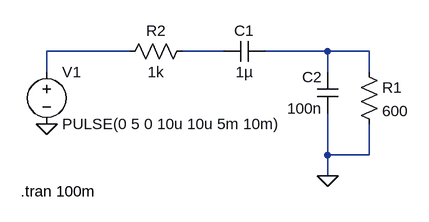
[diagram p0: schematic lab4_tob.asc]
lab4_tob.asc, the LTspice schematic file:
Version 4.1
SHEET 1 880 680
WIRE 256 128 128 128
WIRE 400 128 336 128
WIRE 560 128 464 128
WIRE 624 128 560 128
WIRE 128 160 128 128
WIRE 560 160 560 128
WIRE 624 160 624 128
WIRE 560 288 560 224
WIRE 624 288 624 240
WIRE 624 288 560 288
WIRE 560 320 560 288
FLAG 560 320 0
FLAG 128 240 0
SYMBOL res 352 112 R90
WINDOW 0 0 56 VBottom 2
WINDOW 3 32 56 VTop 2
SYMATTR InstName R2
SYMATTR Value 1k
SYMBOL cap 464 112 R90
WINDOW 0 0 32 VBottom 2
WINDOW 3 32 32 VTop 2
SYMATTR InstName C1
SYMATTR Value 1µ
SYMBOL cap 576 224 R180
WINDOW 0 24 56 Left 2
WINDOW 3 24 8 Left 2
SYMATTR InstName C2
SYMATTR Value 100n
SYMBOL res 608 144 R0
SYMATTR InstName R1
SYMATTR Value 600
SYMBOL voltage 128 144 R0
WINDOW 123 0 0 Left 0
WINDOW 39 0 0 Left 0
SYMATTR InstName V1
SYMATTR Value PULSE(0 5 0 10u 10u 5m 10m)
TEXT 88 344 Left 2 !.tran 100m

The netlist it stands for:
* lab4_tob.asc
R2 N002 N001 1k
C1 N003 N002 1µ
C2 0 N003 100n
R1 N003 0 600
V1 N001 0 PULSE(0 5 0 10u 10u 5m 10m)
.tran 100m
.backanno
.end